# Altium schematic sheet Function Block Diagram.SchDoc
size A4; SheetNumber: 1; SheetTotal: 12
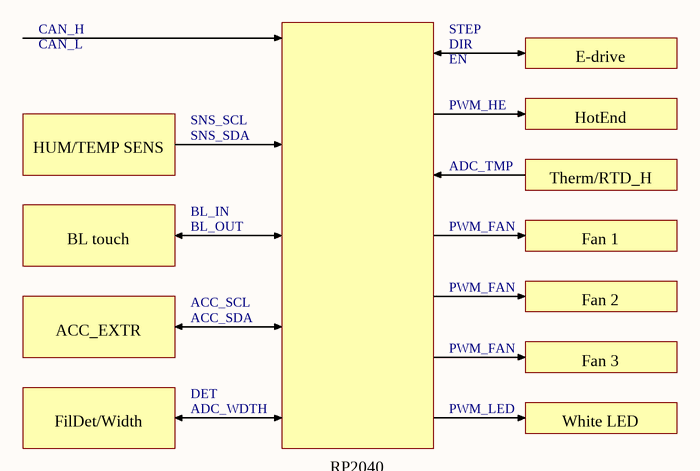
[diagram p0: Function Block Diagram.SchDoc]

## Notes on the sheet
- CAN_H
- CAN_L
- STEP
- DIR
- SNS_SCL
- EN
- PWM_HE
- E-drive
- HotEnd
- HUM/TEMP SENS
- SNS_SDA
- ADC_TMP
- Therm/RTD_H
- BL touch
- BL_IN
- BL_OUT
- PWM_FAN
- Fan 1
- ACC_EXTR
- ACC_SCL
- ACC_SDA
- Fan 2
- DET
- ADC_WDTH
- PWM_LED
- Fan 3
- White LED
- FilDet/Width
- RP2040